# Altium schematic sheet MCUs.SchDoc: MCUs
size A4; Author: João Guimarães; Organization: Altium Limited; Address1: L3, 12a Rodborough Rd; Address2: Frenchs Forest; Address3: NSW; Address4: Australia 2086; SheetNumber: 3; SheetTotal: 7; Version: 1.0.0; Project: Automotive Network EVB; PCB: MainBoard
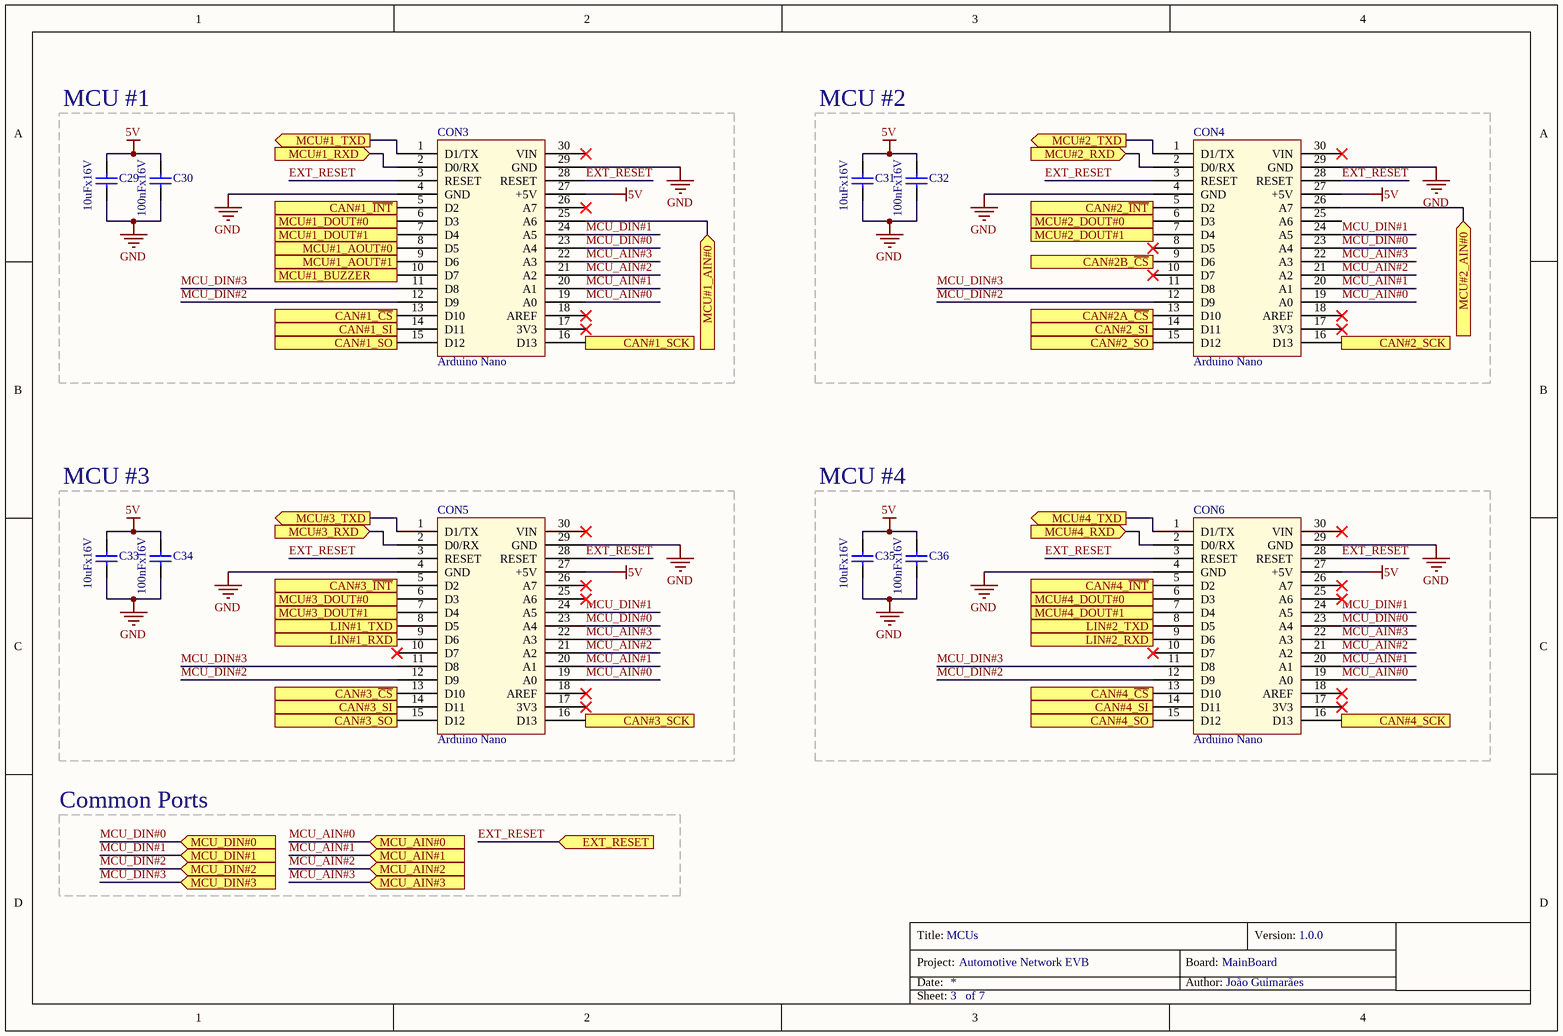
[diagram p0: MCUs.SchDoc]

## Parts
C29  10uFx16V  [DISC-0805]
C30  100nFx16V  [DISC-0603]
C31  10uFx16V  [DISC-0805]
C32  100nFx16V  [DISC-0603]
C33  10uFx16V  [DISC-0805]
C34  100nFx16V  [DISC-0603]
C35  10uFx16V  [DISC-0805]
C36  100nFx16V  [DISC-0603]
CON3  Arduino Nano  [MOD-ARDUINO-NANO]
CON4  Arduino Nano  [MOD-ARDUINO-NANO]
CON5  Arduino Nano  [MOD-ARDUINO-NANO]
CON6  Arduino Nano  [MOD-ARDUINO-NANO]

## Blocks framed on the sheet
MCU #1: C29 C30 CON3
MCU #2: C31 C32 CON4
MCU #3: C33 C34 CON5
MCU #4: C35 C36 CON6

## Ports
CAN#1_SCK (out), CAN#1_SI (out), CAN#1_SO (in), CAN#1_~{CS} (out), CAN#1_~{INT} (out), CAN#2_SCK (out), CAN#2_SI (out), CAN#2_SO (in), CAN#2_~{INT} (out), CAN#2A_~{CS} (out), CAN#2B_~{CS} (out), CAN#3_SCK (out), CAN#3_SI (out), CAN#3_SO (in), CAN#3_~{CS} (out), CAN#3_~{INT} (out), CAN#4_SCK (out), CAN#4_SI (out), CAN#4_SO (in), CAN#4_~{CS} (out), CAN#4_~{INT} (out), EXT_RESET (in), LIN#1_RXD (out), LIN#1_TXD (in), LIN#2_RXD (out), LIN#2_TXD (in), MCU#1_AIN#0 (in), MCU#1_AOUT#0 (out), MCU#1_AOUT#1 (out), MCU#1_BUZZER (out), MCU#1_DOUT#0 (out), MCU#1_DOUT#1 (out), MCU#1_RXD (in), MCU#1_TXD (out), MCU#2_AIN#0 (in), MCU#2_DOUT#0 (out), MCU#2_DOUT#1 (out), MCU#2_RXD (in), MCU#2_TXD (out), MCU#3_DOUT#0 (out), MCU#3_DOUT#1 (out), MCU#3_RXD (in), MCU#3_TXD (out), MCU#4_DOUT#0 (out), MCU#4_DOUT#1 (out), MCU#4_RXD (in), MCU#4_TXD (out), MCU_AIN#0 (in), MCU_AIN#1 (in), MCU_AIN#2 (in), MCU_AIN#3 (in), MCU_DIN#0 (in), MCU_DIN#1 (in), MCU_DIN#2 (in), MCU_DIN#3 (in)

## Nets
5V: C29.1 C30.1 C31.1 C32.1 C33.1 C34.1 C35.1 C36.1 CON3.27(+5V) CON4.27(+5V) CON5.27(+5V) CON6.27(+5V)
GND: C29.2 C30.2 C31.2 C32.2 C33.2 C34.2 C35.2 C36.2 CON3.4(GND) CON3.29(GND) CON4.4(GND) CON4.29(GND) CON5.4(GND) CON5.29(GND) CON6.4(GND) CON6.29(GND)
CAN#1_~{CS}: CON3.13(D10) ; port CAN#1_~{CS}
CAN#1_~{INT}: CON3.5(D2) ; port CAN#1_~{INT}
CAN#1_SCK: CON3.16(D13) ; port CAN#1_SCK
CAN#1_SI: CON3.14(D11) ; port CAN#1_SI
CAN#1_SO: CON3.15(D12) ; port CAN#1_SO
CAN#2_~{INT}: CON4.5(D2) ; port CAN#2_~{INT}
CAN#2_SCK: CON4.16(D13) ; port CAN#2_SCK
CAN#2_SI: CON4.14(D11) ; port CAN#2_SI
CAN#2_SO: CON4.15(D12) ; port CAN#2_SO
CAN#2A_~{CS}: CON4.13(D10) ; port CAN#2A_~{CS}
CAN#2B_~{CS}: CON4.9(D6) ; port CAN#2B_~{CS}
CAN#3_~{CS}: CON5.13(D10) ; port CAN#3_~{CS}
CAN#3_~{INT}: CON5.5(D2) ; port CAN#3_~{INT}
CAN#3_SCK: CON5.16(D13) ; port CAN#3_SCK
CAN#3_SI: CON5.14(D11) ; port CAN#3_SI
CAN#3_SO: CON5.15(D12) ; port CAN#3_SO
CAN#4_~{CS}: CON6.13(D10) ; port CAN#4_~{CS}
CAN#4_~{INT}: CON6.5(D2) ; port CAN#4_~{INT}
CAN#4_SCK: CON6.16(D13) ; port CAN#4_SCK
CAN#4_SI: CON6.14(D11) ; port CAN#4_SI
CAN#4_SO: CON6.15(D12) ; port CAN#4_SO
EXT_RESET: CON3.3(RESET) CON3.28(RESET) CON4.3(RESET) CON4.28(RESET) CON5.3(RESET) CON5.28(RESET) CON6.3(RESET) CON6.28(RESET) ; port EXT_RESET
LIN#1_RXD: CON5.9(D6) ; port LIN#1_RXD
LIN#1_TXD: CON5.8(D5) ; port LIN#1_TXD
LIN#2_RXD: CON6.9(D6) ; port LIN#2_RXD
LIN#2_TXD: CON6.8(D5) ; port LIN#2_TXD
MCU#1_AIN#0: CON3.25(A6) ; port MCU#1_AIN#0
MCU#1_AOUT#0: CON3.8(D5) ; port MCU#1_AOUT#0
MCU#1_AOUT#1: CON3.9(D6) ; port MCU#1_AOUT#1
MCU#1_BUZZER: CON3.10(D7) ; port MCU#1_BUZZER
MCU#1_DOUT#0: CON3.6(D3) ; port MCU#1_DOUT#0
MCU#1_DOUT#1: CON3.7(D4) ; port MCU#1_DOUT#1
MCU#1_RXD: CON3.2(D0/RX) ; port MCU#1_RXD
MCU#1_TXD: CON3.1(D1/TX) ; port MCU#1_TXD
MCU#2_AIN#0: CON4.26(A7) ; port MCU#2_AIN#0
MCU#2_DOUT#0: CON4.6(D3) ; port MCU#2_DOUT#0
MCU#2_DOUT#1: CON4.7(D4) ; port MCU#2_DOUT#1
MCU#2_RXD: CON4.2(D0/RX) ; port MCU#2_RXD
MCU#2_TXD: CON4.1(D1/TX) ; port MCU#2_TXD
MCU#3_DOUT#0: CON5.6(D3) ; port MCU#3_DOUT#0
MCU#3_DOUT#1: CON5.7(D4) ; port MCU#3_DOUT#1
MCU#3_RXD: CON5.2(D0/RX) ; port MCU#3_RXD
MCU#3_TXD: CON5.1(D1/TX) ; port MCU#3_TXD
MCU#4_DOUT#0: CON6.6(D3) ; port MCU#4_DOUT#0
MCU#4_DOUT#1: CON6.7(D4) ; port MCU#4_DOUT#1
MCU#4_RXD: CON6.2(D0/RX) ; port MCU#4_RXD
MCU#4_TXD: CON6.1(D1/TX) ; port MCU#4_TXD
MCU_AIN#0: CON3.19(A0) CON4.19(A0) CON5.19(A0) CON6.19(A0) ; port MCU_AIN#0
MCU_AIN#1: CON3.20(A1) CON4.20(A1) CON5.20(A1) CON6.20(A1) ; port MCU_AIN#1
MCU_AIN#2: CON3.21(A2) CON4.21(A2) CON5.21(A2) CON6.21(A2) ; port MCU_AIN#2
MCU_AIN#3: CON3.22(A3) CON4.22(A3) CON5.22(A3) CON6.22(A3) ; port MCU_AIN#3
MCU_DIN#0: CON3.23(A4) CON4.23(A4) CON5.23(A4) CON6.23(A4) ; port MCU_DIN#0
MCU_DIN#1: CON3.24(A5) CON4.24(A5) CON5.24(A5) CON6.24(A5) ; port MCU_DIN#1
MCU_DIN#2: CON3.12(D9) CON4.12(D9) CON5.12(D9) CON6.12(D9) ; port MCU_DIN#2
MCU_DIN#3: CON3.11(D8) CON4.11(D8) CON5.11(D8) CON6.11(D8) ; port MCU_DIN#3

Not connected (* = marked no-connect by the designer): CON3 17(3V3)* 18(AREF)* 26(A7)* 30(VIN)*; CON4 8(D5)* 10(D7)* 17(3V3)* 18(AREF)* 25(A6) 30(VIN)*; CON5 10(D7)* 17(3V3)* 18(AREF)* 25(A6)* 26(A7)* 30(VIN)*; CON6 10(D7)* 17(3V3)* 18(AREF)* 25(A6)* 26(A7)* 30(VIN)*

## Notes on the sheet
- Common Ports
- Title:
- Project:
- Date:
- Author:
- Board:
- Version:
- Sheet:
- of

## Library data of the parts
C29 C31 C33 C35 = Cap: Capacitor; PartNumber1: EMK212ABJ106MG-T; Manufacturer1: TaiyoYuden; ClassName: Mcu
C30 C32 C34 C36 = Cap: Capacitor; PartNumber1: C0603C104Z3VACTU; Manufacturer1: Kemet; ClassName: Mcu
CON3-CON6 = Arduino Nano: ClassName: Mcu